# Altium schematic sheet Louver Control.SchDoc
size A4; SheetNumber: 9; SheetTotal: 9
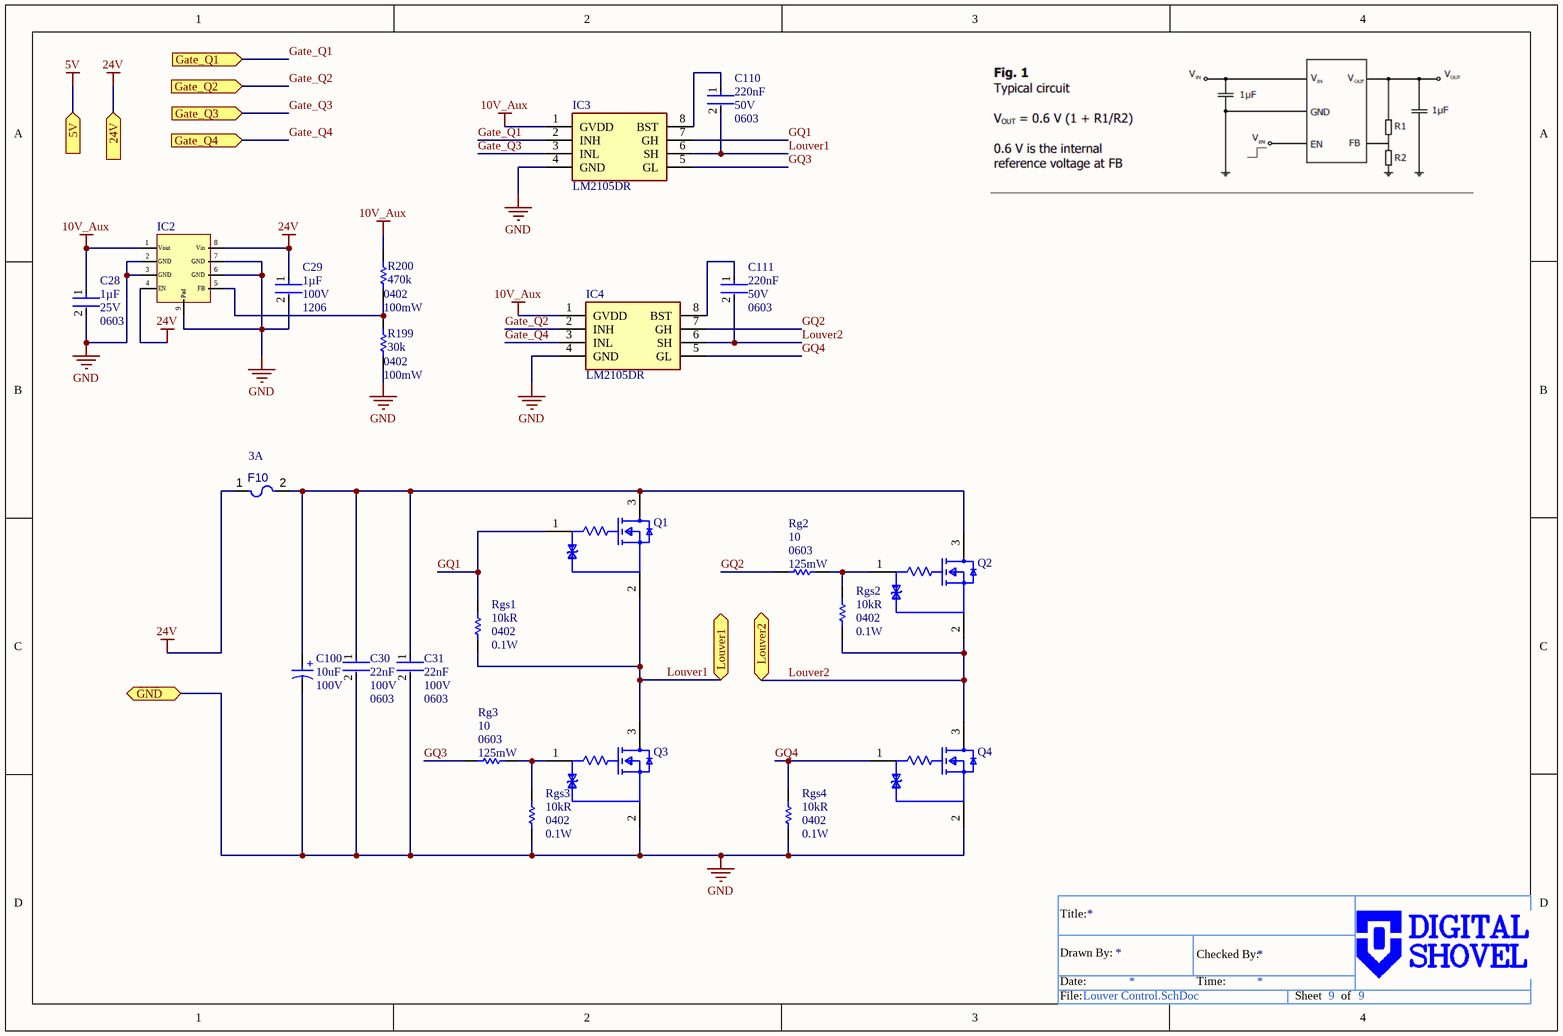
[diagram p0: Louver Control.SchDoc]

## Parts
C28  value 1µF  Voltage Rating: 25V  Case/Package: 0603  [FP-CL10-IPC_A]  (hidden comment: CL10B105KA8NNNC)
C29  value 1µF  Voltage Rating: 100V  Case/Package: 1206  [FP-CL31-IPC_A]  (hidden comment: CL31B105KCHSNNE)
C30  value 22nF  Voltage Rating: 100V  Case/Package: 0603  [FP-C0603C-CF-IPC_A]  (hidden comment: C0603C223K1RACAUTO)
C31  value 22nF  Voltage Rating: 100V  Case/Package: 0603  [FP-C0603C-CF-IPC_A]  (hidden comment: C0603C223K1RACAUTO)
C100  value 10uF  Voltage Rating: 100V  [WCAP-ASLL_D6.3H7.7]  (hidden comment: 865060845002)
C110  value 220nF  Voltage Rating: 50V  Case/Package: 0603  [FP-CL10-IPC_A]  (hidden comment: CL10B224KB8VPNC)
C111  value 220nF  Voltage Rating: 50V  Case/Package: 0603  [FP-CL10-IPC_A]  (hidden comment: CL10B224KB8VPNC)
F10  Current Rating: 3A  [0679H3000-05-Footprint-1]  (hidden comment: 0679H3000-05)
IC2  LDI55-ADEEN  [LDI55-ADEEN-Footprint-1]  (value not drawn)
IC3  LM2105DR  [LM2105DR-Footprint-1]
IC4  LM2105DR  [LM2105DR-Footprint-1]
Q1  SSM3K361R,LF  [FP-2-3Z1S-MFG]  (value not drawn)
Q2  SSM3K361R,LF  [FP-2-3Z1S-MFG]  (value not drawn)
Q3  SSM3K361R,LF  [FP-2-3Z1S-MFG]  (value not drawn)
Q4  SSM3K361R,LF  [FP-2-3Z1S-MFG]  (value not drawn)
R199  value 30k  Power: 100mW  Case/Package: 0402  [RESC1005X40X25LL10T10]  (hidden comment: RK73H1ETTP3002F)
R200  value 470k  Case/Package: 0402  Power: 100mW  [RESC1005X40X25LL10T10]  (hidden comment: RK73H1ETTP4703F)
Rg2  value 10  Case/Package: 0603  Power: 125mW  [FP-RK73H1J-IPC_A]  (hidden comment: RK73H1JTTDD10R0F)
Rg3  value 10  Case/Package: 0603  Power: 125mW  [FP-RK73H1J-IPC_A]  (hidden comment: RK73H1JTTDD10R0F)
Rgs1  value 10kR  Package: 0402  Power Rating: 0.1W  [RESC1005X40X25LL10T10]  (hidden comment: RK73H1ETTP1002F)
Rgs2  value 10kR  Package: 0402  Power Rating: 0.1W  [RESC1005X40X25LL10T10]  (hidden comment: RK73H1ETTP1002F)
Rgs3  value 10kR  Package: 0402  Power Rating: 0.1W  [RESC1005X40X25LL10T10]  (hidden comment: RK73H1ETTP1002F)
Rgs4  value 10kR  Package: 0402  Power Rating: 0.1W  [RESC1005X40X25LL10T10]  (hidden comment: RK73H1ETTP1002F)

## Ports
5V (in), 24V (in), Gate_Q1 (in), Gate_Q2 (in), Gate_Q3 (in), Gate_Q4 (in), GND (bidir), Louver1 (bidir), Louver2 (bidir)

## Nets
5V: port 5V
10V_Aux: C28.1 IC2.1(Vout) IC3.1(GVDD) IC4.1(GVDD) R200.2
24V: C29.1 F10.1 IC2.4(EN) IC2.8(Vin) ; port 24V
GND: C28.2 C29.2 C30.2 C31.2 C100.2(N) IC2.2(GND) IC2.3(GND) IC2.6(GND) IC2.7(GND) IC2.9(Pad) IC3.4(GND) IC4.4(GND) Q3.2(Source) Q4.2(Source) R199.1 Rgs3.1 Rgs4.1 ; port GND
Gate_Q1: IC3.2(INH) ; port Gate_Q1
Gate_Q2: IC4.2(INH) ; port Gate_Q2
Gate_Q3: IC3.3(INL) ; port Gate_Q3
Gate_Q4: IC4.3(INL) ; port Gate_Q4
GQ1: IC3.7(GH) Q1.1(Gate) Rgs1.2
GQ2: IC4.7(GH) Rg2.1
GQ3: IC3.5(GL) Rg3.1
GQ4: IC4.5(GL) Q4.1(Gate) Rgs4.2
Louver1: C110.2 IC3.6(SH) Q1.2(Source) Q3.3(Drain) Rgs1.1 ; port Louver1
Louver2: C111.2 IC4.6(SH) Q2.2(Source) Q4.3(Drain) Rgs2.1 ; port Louver2
NetC30_1: C30.1 C31.1 C100.1(P) F10.2 Q1.3(Drain) Q2.3(Drain)
NetC110_1: C110.1 IC3.8(BST)
NetC111_1: C111.1 IC4.8(BST)
NetIC2_5: IC2.5(FB) R199.2 R200.1
NetQ2_1: Q2.1(Gate) Rg2.2 Rgs2.2
NetQ3_1: Q3.1(Gate) Rg3.2 Rgs3.2

## Notes on the sheet
- Title:
- Date:
- Drawn By:
- Time:
- Checked By:
- File:
- Sheet
- of
- (in symbol CMP-001-00357-1) +

## Library data of the parts
C28 = CMP-001-00231-4: Ceramic Capacitor, Multilayer, Ceramic, 25V, 10% +Tol, 10% -Tol, X7R, 15% TC, 1uF, Surface Mount, 0603; Template: SS_0603_C; Pins: 2; Capacitor Type: Ceramic; RoHS Compliant: Yes; Max Operating Temperature: 125°C; Mounting Technology: Surface Mount; Min Operating Temperature: -55°C
C29 = CMP-001-00354-1: Ceramic Capacitor, Multilayer, Ceramic, 100V, 10% +Tol, 10% -Tol, X7R, 15% TC, 1uF, Surface Mount, 1206; Capacitor Type: Ceramic; RoHS Compliant: Yes; Min Operating Temperature: -55°C; Max Operating Temperature: 125°C; Mounting Technology: Surface Mount; Pins: 2
C30 C31 = CMP-001-00355-1: Ceramic Capacitor, Ceramic, 100V, 10% +Tol, 10% -Tol, X7R, 15% TC, 0.022uF, Surface Mount, 0603; RoHS Compliant: Yes; Min Operating Temperature: -55°C; Mounting Technology: Surface Mount; Max Operating Temperature: 125°C; Pins: 2; Capacitor Type: Ceramic
C100 = CMP-001-00357-1: Cap, 10Uf, 100V, Alu Elec, Smd, Radial Rohs Compliant: Yes
C110 C111 = CMP-001-00356-1: Ceramic Capacitor, Multilayer, Ceramic, 50V, 10% +Tol, 10% -Tol, X7R, 15% TC, 0.22uF, Surface Mount, 0603; Mounting Technology: Surface Mount; Max Operating Temperature: 125°C; Capacitor Type: Ceramic; Pins: 2; Min Operating Temperature: -55°C; RoHS Compliant: Yes
F10 = CMP-005-00026-1: Electric Fuse, Very Fast Blow, 3A, 350VAC, 72VDC, 50A (IR), Surface Mount, 2410; Min Operating Temperature: -55°C; RoHS Compliant: Yes; Max Operating Temperature: 125°C
IC2 = CMP-031-00039-3: Linear Voltage Regulator IC Positive Adjustable 1 Output 1A 8-ESOP
IC3 IC4 = CMP-031-00040-1: 107-V 0.5-A/0.8-A half-bridge gate driver with 5-V UVLO and integrated bootstrap diode 8-SOIC -40 to 125
Q1-Q4 = CMP-031-00038-1: N-Channel 100 V 3.5A (Ta) 1.2W (Ta) Surface Mount SOT-23F
R199 = CMP-009-01041-1: Fixed Resistor, Metal Glaze/thick Film, 0.1W, 30000ohm, 75V, 1% +/-Tol, 100ppm/Cel, Surface Mount, 0402; Pins: 2; Tolerance: 1%; Mounting Technology: Surface Mount; RoHS Compliant: Yes; Min Operating Temperature: -55°C; Max Operating Temperature: 155°C
R200 = CMP-009-01042-1: Fixed Resistor, Metal Glaze/thick Film, 0.1W, 470000ohm, 75V, 1% +/-Tol, 100ppm/Cel, Surface Mount, 0402; Tolerance: 1%; Min Operating Temperature: -55°C; Mounting Technology: Surface Mount; Max Operating Temperature: 155°C; Pins: 2; RoHS Compliant: Yes
Rg2 Rg3 = CMP-009-01040-1: Fixed Resistor, Metal Glaze/thick Film, 0.125W, 10ohm, 75V, 1% +/-Tol, 100ppm/Cel, Surface Mount, 0603; Max Operating Temperature: 155°C; Pins: 2; RoHS Compliant: Yes; Mounting Technology: Surface Mount; Min Operating Temperature: -55°C; Tolerance: 1%
Rgs1-Rgs4 = CMP-x00150-2: Fixed Resistor, Metal Glaze/thick Film, 0.1W, 10000ohm, 75V, 1% +/-Tol, 100ppm/Cel, Surface Mount, 0402; Template: KS_0402_R